# EAGLE design EnergyMonitorV1.0 (EAGLE 9.3.0)
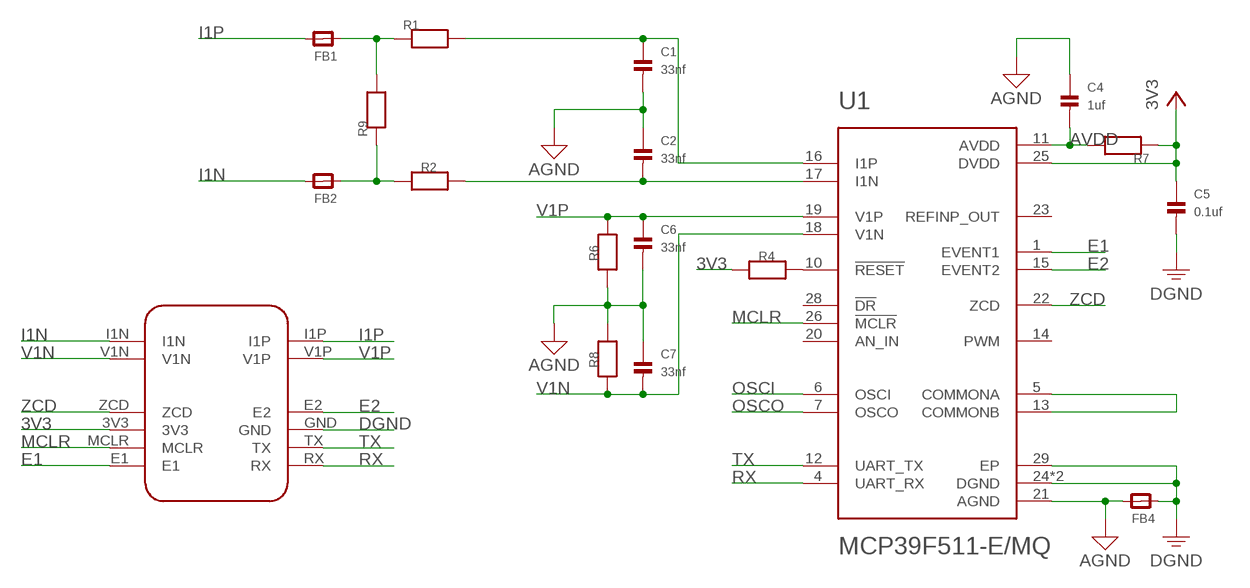
[diagram p0: schematic, sheet 1]

## Parts
C1  33nf  CAP_CERAMIC0603  [0603]
C2  33nf  CAP_CERAMIC0603  [0603]
C4  1uf  CAP_CERAMIC0603  [0603]
C5  0.1uf  CAP_CERAMIC0603  [0603]
C6  33nf  CAP_CERAMIC0603  [0603]
C7  33nf  CAP_CERAMIC0603  [0603]
FB1  FERRITE_0603  [_0603]
FB2  FERRITE_0603  [_0603]
FB4  FERRITE_0603  [_0603]
R1  1k  RESISTOR0603  [0603]
R2  1k  RESISTOR0603  [0603]
R4  10R  RESISTOR0603  [0603]
R6  1k  RESISTOR0603  [0603]
R7  10R  RESISTOR0603  [0603]
R8  1k  RESISTOR0603  [0603]
R9  2.49  RESISTOR0603  [0603]
U1  MCP39F511-E/MQ  [QFN50P500X500X100-29N]
U$1  PMIC  [PMIC]

## Nets
3V3: C5.1 R4.1 R7.1 U1.25(DVDD) U$1.3V3
AGND: C1.2 C2.1 C4.1 C6.2 C7.1 FB4.1 R6.1 R8.2 U1.21(AGND)
AVDD: C4.2 R7.2 U1.11(AVDD)
DGND: C5.2 FB4.2 U1.24(DGND) U1.27(DGND) U1.29(EP) U$1.GND
E1: U1.1(EVENT1) U$1.E1
E2: U1.15(EVENT2) U$1.E2
I1N: FB2.1 U$1.I1N
I1P: FB1.1 U$1.I1P
MCLR: U1.26(!MCLR) U$1.MCLR
N$1: C1.1 R1.2 U1.16(I1P)
N$2: C2.2 R2.2 U1.17(I1N)
N$4: U1.5(COMMONA) U1.13(COMMONB)
N$6: R4.2 U1.10(!RESET)
N$16: FB1.2 R1.1 R9.2
N$17: FB2.2 R2.1 R9.1
OSCI: U1.6(OSCI)
OSCO: U1.7(OSCO)
RX: U1.4(UART_RX) U$1.RX
TX: U1.12(UART_TX) U$1.TX
V1N: C7.2 R8.1 U1.18(V1N) U$1.V1N
V1P: C6.1 R6.2 U1.19(V1P) U$1.V1P
ZCD: U1.22(ZCD) U$1.ZCD
Unconnected: U1.14(PWM) U1.20(AN_IN) U1.23(REFINP_OUT) U1.28(!DR)

## Library data of the parts
C1 C2 C4-C7 = microbuilder:CAP_CERAMIC: Ceramic Capacitors 0402 - 0402 Surface Mount Capacitors 16pF 50V 5% [Digikey: 445-4899-2-ND] 18pF 50V 5% [Digikey: 490-1281-2-ND] 22pF 50V 5% [Digikey: 490-1283-2-ND] 68pF 50V 5% [Digikey: 490-1289-2-ND] 0.1uF 10V 10% [Digikey: 490-1318-2-ND] 1.0uF 6.3V 10% [Digikey: 490-1320-2-ND] 0603 - 0603 Surface Mount Capacitors 16 pF 50V 5% [Digikey: 445-5051-2-ND] 22 pF 50V [Digikey: PCC220ACVTR-ND] 33 pF 50V 5% [Digikey: 490-1415-1-ND] 56pF 50V 5% [Digikey: 490-1421-1-ND] 220pF 50V 5% [Digikey: 445-1285-1-ND] 680 pF 50V 2200 pF 50V 5% C0G [Digikey: 445-1297-1-ND] 5600 pF 100V 5% X7R [Digikey: 478-3711-1-ND] 0.1 µF 25V 10% [Digikey: PCC2277TR-ND] 0.22 µF 16V 10% X7R [Digikey: 445-1318-1-ND] 1.0 µF 25V 10% [Digikey: 445-5146-2-ND] 0603 - RF Specific 3pF 250V +/-0.1pF RF [Digikey: 712-1347-1-ND] 18 pF 250V 5% [Digikey: 478-3505-1-ND or 712-1322-1-ND] 56 pF 250V 5% C0G RF [Digikey: 490-4867-1-ND] 68 pF 250V RF [Digikey: 490-4868-1-ND] 0805 - 0805 Surface Mount Capacitors 220 pF 250V 2% RF Ceramic Capacitor [Digikey: 712-1398-1-ND] 1000 pF 50V 2% NP0 Ceramic Capacitor [Digikey: 478-3760-1-ND] 0.1 µF 25V 10% Ceramic Capacitor [Digikey: PCC1828TR-ND] 1.0 µF 16V 10% Ceramic Capacitor[Digikey: 490-1691-2-ND] 10.0 µF 10V 10% Ceramic Capacitor[Digikey: 709-1228-1-ND] 10.0 uF 16V 10% Ceramic Capacitor [Digikey: 478-5165-2-ND] 47 uF 6.3V 20% Ceramic Capacitor [Digikey: 587-1779-1-ND or 399-5506-1-ND] 1206 - 1206 Surface Mount Capacitors 47uF 10V 20% Ceramic Capacitor [Digikey: 490-5528-1-ND or 399-5508-1-ND or 445-6010-1-ND] 100uF 6.3V -20%, +80% Y5V Ceramic Capacitor (Digikey: 490-4512-1-ND, Mouser: 81-GRM31CF50J107ZE1L)
FB1 FB2 FB4 = microbuilder:FERRITE: Ferrite Bead 0603 MMZ1608B121C - 120 Ohm @ 100MHz, 600mA, 0.15 Ohm DC Resistance - Digikey: 445-2164-1-ND BK1608HW121-T - 120 Ohm, 600mA Ferrite Chip - Digikey: 587-1876-2-ND 0805 HZ0805B272R-10 - 2.7K Ohm @ 100MHz, 200mA, 0.8 Ohm DC Resistance - Digikey: 240-2504-1-ND (see also Murata BLM21BD272SN1L) MMZ2012Y152B - 1.5K Ohm @ 100MHz, 500mA, 0.4 Ohm DC Resistance - Digikey: 445-1560-1-ND - Mainly for high frequency (80-400MHz) MMZ2012R102A - 1K Ohm @ 100MHz, 500mA, 0.3 Ohm DC Resistance - Digikey: 445-1555-2-ND - More general purpose (10-200MHz)
R1 R2 R4 R6-R9 = microbuilder:RESISTOR: Resistors 0402 - 0402 Surface Mount Package 22 Ohm 1% 1/16W [Digikey: 311-22.0LRTR-ND] 33 Ohm 5% 1/16W 1.0K 5% 1/16W 1.5K 5% 1/16W 2.0K 1% 1/16W 10.0K 1% 1/16W [Digikey: 311-10.0KLRTR-ND] 10.0K 5% 1/16W [Digikey: RMCF0402JT10K0TR-ND] 12.1K 1% 1/16W [Digikey: 311-22.0LRTR-ND] 100.0K 5% 1/16W 0603 - 0603 Surface Mount Package 0 Ohm 1/10 Watt 1% Resistor 15 Ohm 1/10 Watt 1% Resistor 33 Ohm 1/10 Watt 1% Resistor 49.9 Ohm 1/10 Watt 1% Resistor 100 Ohm 1/10 Watt 1% Resistor 150 Ohm 1/10 Watt 1% Resistor 240 Ohm 1/10 Watt 1% Resistor 390 Ohm 1/10 Watt 1% Resistor 560 Ohm 1/10 Watt 1% Resistor 680 Ohm 1/10 Watt 1% Resistor 750 Ohm 1/10 Watt 1% Resistor 1.0K Ohm 1/10 Watt 1% Resistor 1.5K Ohm 1/10 Watt 1% Resistor 2.0K Ohm 1/10 Watt 1% Resistor 2.2K Ohm 1/10 Watt 1% Resistor 3.3K Ohm 1/10 Watt 1% Resistor 4.7K Ohm 1/10 Watt 1% Resistor 10.0K Ohm 1/10 Watt 1% Resistor 12.0K Ohm 1/10 Watt 1% Resistor 12.1K Ohm 1/10 Watt 1% Resistor 20.0K Ohm 1/10 Watt 1% Resistor 33.0K Ohm 1/10 Watt 1% Resistor 100.0K Ohm 1/10 Watt 1% Resistor 0805 - 0805 Surface Mount Package 0 Ohm 1/8 Watt 1% Resistor 33 Ohm 1/8 Watt 1% Resistor 100 Ohm 1/8 Watt 1% Resistor 150 Ohm 1/8 Watt 1% Resistor 200 Ohm 1/8 Watt 1% Resistor 240 Ohm 1/8 Watt 1% Resistor 330 Ohm 1/8 Watt 1% Resistor 390 Ohm 1/8 Watt 1% Resistor 470 Ohm 1/8 Watt 1% Resistor 1.0K Ohm 1/8 Watt 1% Resistor 1.5K Ohm 1/8 Watt 1% Resistor 2.0K Ohm 1/8 Watt 1% Resistor 4.7K Ohm 1/8 Watt 1% Resistor 5.1K Ohm 1/8 Watt 1% Resistor 5.6K Ohm 1/8 Watt 1% Resistor 10.0K Ohm 1/8 Watt 1% Resistor 22.0K Ohm 1/8 Watt 1% Resistor 33.0K Ohm 1/8 Watt 1% Resistor 100K Ohm 1/8 Watt 1% Resistor 1206 - 1206 Surface Mount Package 2012 - 2010 Surface Mount Package 0.11 Ohm 1/2 Watt 1% Resistor - Digikey: RHM.11UCT-ND
U1 = MCP39F511-E_MQ:MCP39F511-E/MQ: Sngl-Phase, Pwr-Monitoring IC w/ Calc &Energy Accumulation 28 QFN 5x5x0.9mm TUB; DESCRIPTION: Sngl-Phase, Pwr-Monitoring IC w/ Calc &Energy Accumulation 28 QFN 5x5x0.9mm TUB; DIGI-KEY_PART_NUMBER: MCP39F511-E/MQ-ND; DIGI-KEY_PURCHASE_URL: https://www.digikey.in/product-detail/en/microchip-technology/MCP39F511-E-MQ/MCP39F511-E-MQ-ND/5323591?utm_source=snapeda&utm_medium=aggregator&utm_campaign=symbol; MF: Microchip; MP: MCP39F511-E/MQ; PACKAGE: QFN-28 Microchip
U$1 = Ei:PMIC

## Board
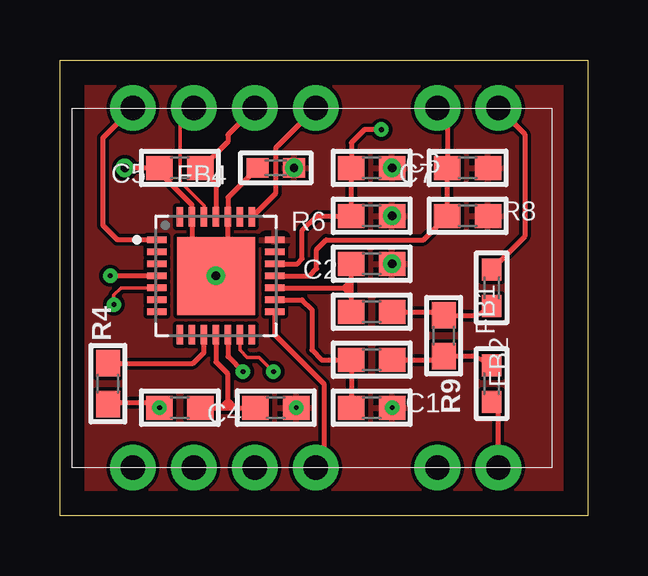
[diagram p1: board, top side]
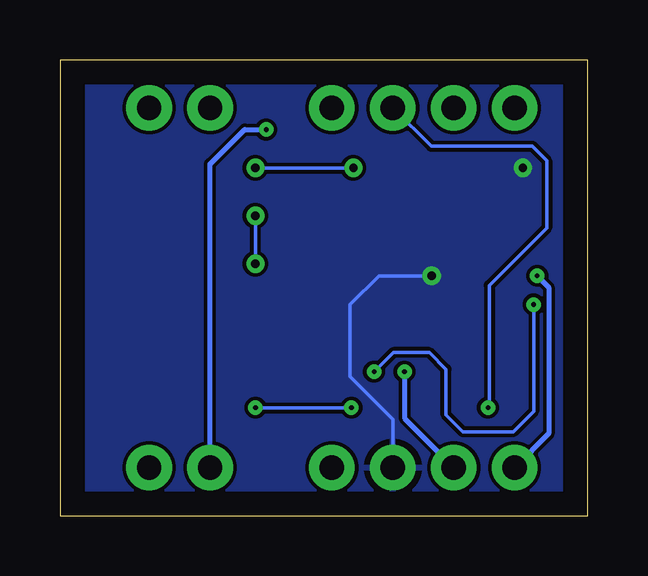
[diagram p2: board, bottom side, seen from below]

Size 22 x 19 mm. Coordinates in mm from the lower left corner, seen from the top.
Outline: 0,0 0,19 22,19 22,0 0,0
Copper layers (1*16): Top 0.035mm / dielectric 1.5mm / Bottom 0.035mm
Design rules "default": minimum track width 6mil, minimum drill 0.35mm, track to track 6mil, track to pad 6mil, pad to pad 6mil, via to via 6mil, smd to smd 6mil, copper to edge 40mil, drill to drill 6mil, minimum pad ring 10mil, minimum via ring 8mil, stop-mask expansion 4mil, vias tented up to drill 0mil, thermal gap 10mil

### Footprints (pad centres in the part's own frame; a part is rotated, then mirrored left to right if it is on the bottom)
0603 = smd 1.1 x 1: 1 -0.85,0; 2 0.85,0
_0603 = smd 0.9 x 0.8: 1 -0.762,0; 2 0.762,0
QFN50P500X500X100-29N = smd 0.81 x 0.26: 1 -2.45,1.5; 2 -2.45,1; 3 -2.45,0.5; 4 -2.45,0; 5 -2.45,-0.5; 6 -2.45,-1; 7 -2.45,-1.5; 15 2.45,-1.5; 16 2.45,-1; 17 2.45,-0.5; 18 2.45,0; 19 2.45,0.5; 20 2.45,1; 21 2.45,1.5 | smd 0.26 x 0.81: 8 -1.5,-2.45; 9 -1,-2.45; 10 -0.5,-2.45; 11 0,-2.45; 12 0.5,-2.45; 13 1,-2.45; 14 1.5,-2.45; 22 1.5,2.45; 23 1,2.45; 24 0.5,2.45; 25 0,2.45; 26 -0.5,2.45; 27 -1,2.45; 28 -1.5,2.45 | smd 3.25 x 3.25: 29 0,0
PMIC = drill 1.016 pad 1.9: 3V3 7.62,15; E1 2.54,15; E2 10.16,0; GND 7.62,0; I1N 17.78,15; I1P 17.78,0; MCLR 5.08,15; RX 2.54,0; TX 5.08,0; V1N 15.24,15; V1P 15.24,0; ZCD 10.16,15

### Placement (x,y rotation side)
C1  13,4.5 0 top
C2  13,10.5 180 top
C4  9,4.5 180 top
C5  5,14.5 180 top
C6  13,14.5 0 top
C7  17,14.5 180 top
FB1  18,5.5 90 top
FB2  18,9.5 270 top
FB4  9,14.5 180 top
R1  13,6.5 180 top
R2  13,8.5 180 top
R4  2,5.5 90 top
R6  13,12.5 180 top
R7  5,4.5 0 top
R8  17,12.5 0 top
R9  16,7.5 270 top
U1  6.5,10 0 top
U$1  0.5,2 0 top

### Tracks (layer width: path | path; a pad name or v marks a point on that pad's centre or on a via)
3V3  (via drill 0.2)
  Top 0.203: R4.1 2.05,4.7 3.95,4.7 R7.1 | U$1.3V3 7,15.88 7,15.6 5.9,14.5 C5.1 6.5,13.85 U1.25
  Bottom 0.152: U$1.3V3 6.52,15.4 2.3,15.4 1.7,14.8 1.7,12 4.1,9.6 4.1,4.55 R7.1
  other vias: 4.15,4.5
AGND  (via drill 0.2, 0.35)
  Bottom 0.152: C1.2 C4.1 | C2.1 R6.1 | C6.2 FB4.1
  other vias: 13.85,4.5 9.85,4.5 13.85,10.5 13.85,12.5 13.85,14.5 9.76,14.5
  pour Top: -0.5,0 -0.5,19.5 22,19.5 22,0
AVDD
  Top 0.203: U1.11 6.5,6.4 7,5.9 7,4.8 | R7.2 6.7,4.5 | 6.7,4.5 7,4.5 | 7,4.5 7.3,4.5 | 7.3,4.5 C4.2 | 7,4.5 7,4.8 | 6.7,4.5 7,4.8 | 7,4.8 7.3,4.5
DGND  (via drill 0.35)
  Top 0.203: FB4.2 7,13.26 U1.24 7,10.5 U1.29 5.5,11 U1.27 5.5,12.95 4.15,14.3 C5.2 v2.7,14.5
  Bottom 0.152: U$1.GND 8.12,4.02 9.9,5.8 9.9,8.8 8.7,10 U1.29
  other vias: 6.5,10
  pour Bottom: -1.5,0 -1.5,19.5 22,19.5 22,0
E1
  Top 0.203: U1.1 2.4,11.5 1.8,12.1 1.8,15.76 U$1.E1
E2
  Top 0.203: U1.15 8.95,7.55 11,5.5 11,2.34 U$1.E2
I1N
  Top 0.203: U$1.I1N 19.38,15.9 19.38,11.64 FB2.1
I1P
  Top 0.203: U$1.I1P 18.28,4.46 FB1.1
MCLR
  Top 0.152: U$1.MCLR 5,16.42 5,13.92 6,12.92 U1.26
N$1
  Top 0.203: U1.16 10.1,9 10.5,8.6 10.5,6.9 10.9,6.5 R1.2 C1.1
N$2
  Top 0.203: R2.2 12.15,9.2 | 12.15,9.2 12.15,9.5 | 12.15,9.5 12.15,9.8 | 12.15,9.8 C2.2 | U1.17 11.85,9.5 | 11.85,9.5 12.15,9.5 | 11.85,9.5 12.15,9.8 | 11.85,9.5 12.15,9.2
N$4  (via drill 0.2)
  Top 0.152: U1.5 2.55,9.5 2.25,9.2 v2.25,8.8 | U1.13 7.5,6.9 7.8,6.6 8.3,6.6 v8.9,6
  Bottom 0.152: v2.25,8.8 2.25,4.35 3.1,3.5 5.2,3.5 5.9,4.2 5.9,6.1 6.6,6.8 8.1,6.8 v8.9,6
N$6
  Top 0.203: R4.2 5.55,6.35 6,6.8 U1.10
N$16
  Top 0.203: R1.1 15.85,6.5 R9.2 17.3,6.65 FB1.2
N$17
  Top 0.203: R2.1 15.85,8.5 R9.1 17.39,8.35 FB2.2
RX  (via drill 0.2)
  Top 0.203: U1.4 v2.1,10
  Bottom 0.203: v2.1,10 1.62,9.52 1.62,3.42 U$1.RX
TX  (via drill 0.2)
  Top 0.203: U1.12 7,6.63 v7.63,6
  Bottom 0.203: v7.63,6 7.63,4.05 U$1.TX
V1N
  Top 0.203: U1.18 10.4,10 10.7,10.3 10.7,11.1 11.1,11.5 15.15,11.5 R8.1 C7.2 16.15,16.59 U$1.V1N
V1P  (via drill 0.2)
  Top 0.203: U1.19 9.9,10.5 10.1,10.7 10.1,11.9 10.7,12.5 R6.2 C6.1 12.15,15.55 12.7,16.1 v13.4,16.1
  Bottom 0.203: U$1.V1P 15.74,14.66 14.3,16.1 v13.4,16.1
ZCD
  Top 0.203: U1.22 9,13.45 9,15.34 U$1.ZCD